# EAGLE schematic Development Board (EAGLE 9.6.2)
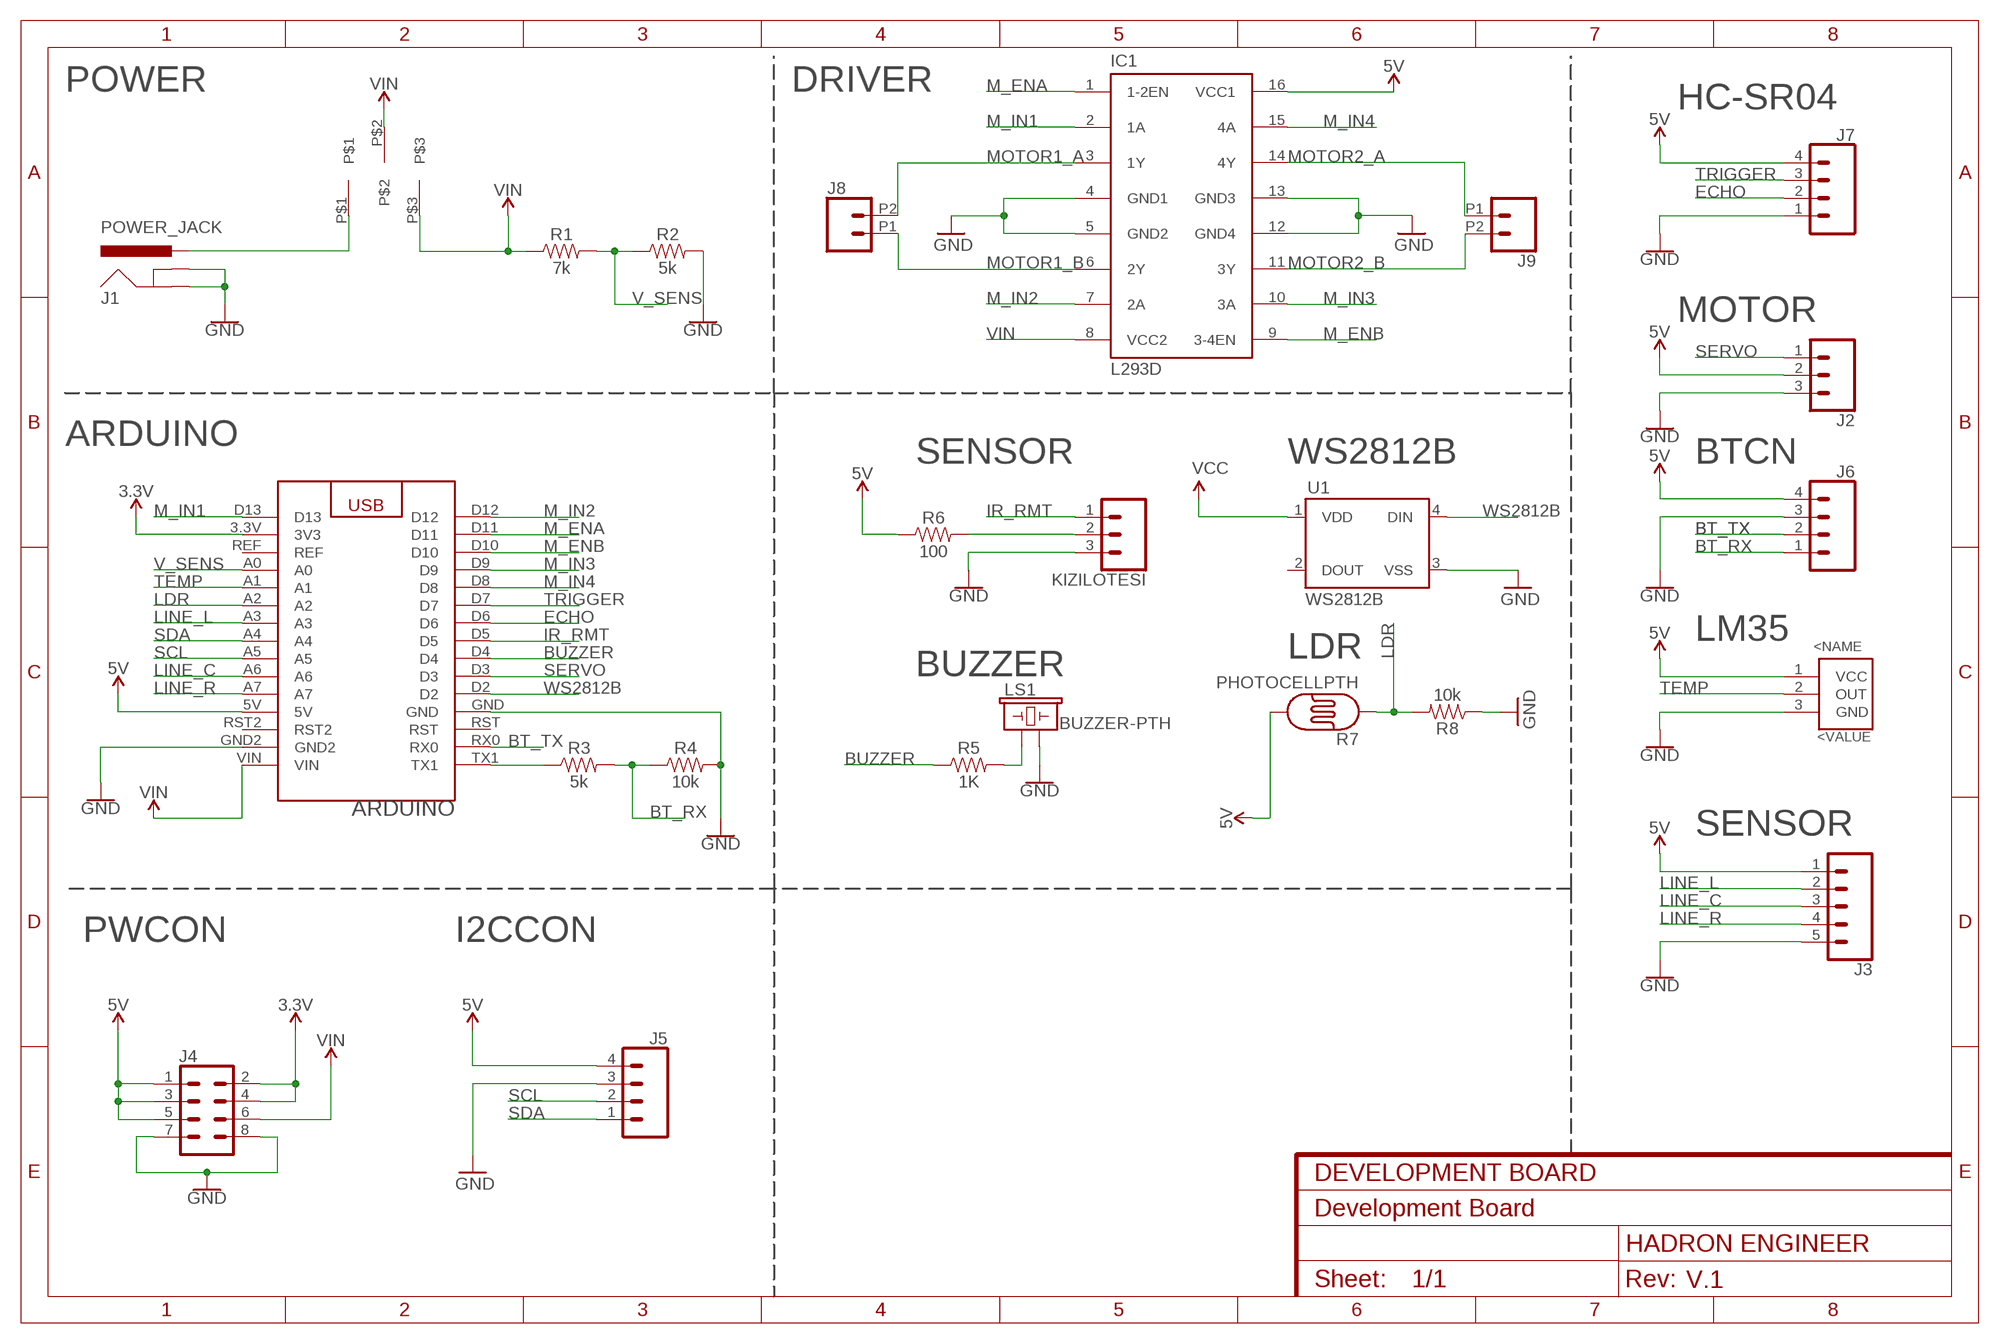
[diagram p0: schematic, sheet 1]
FRAME1 (FRAME-A4L): CNAME: DEVELOPMENT BOARD; CREVISION: V.1; DESIGNER: HADRON ENGINEER

## Parts
ARDUINO  ARDUINONANO  [ARDUINONANO]
IC1  L293D  [DIL16]
J1  POWER_JACK  [POWER_JACK_PTH]
J2  CONN_03  [1X03]
J3  CONN_05  [1X05]
J4  CONN_04X2  [2X4]
J5  CONN_04  [1X04]
J6  CONN_04  [1X04]
J7  CONN_04  [1X04]
J8  CONN_022.54MM_SCREWTERM  [1X02_2.54_SCREWTERM]
J9  CONN_022.54MM_SCREWTERM  [1X02_2.54_SCREWTERM]
KIZILOTESI  CONN_03  [1X03]
LM35  LM35  [TO-92]
LS1  BUZZER-PTH  [BUZZER-12MM]
R1  7k  10MOHM-HORIZ-1/4W-5%  [AXIAL-0.3]
R2  5k  10MOHM-HORIZ-1/4W-5%  [AXIAL-0.3]
R3  5k  10MOHM-HORIZ-1/4W-5%  [AXIAL-0.3]
R4  10k  10MOHM-HORIZ-1/4W-5%  [AXIAL-0.3]
R5  1K  10MOHM-HORIZ-1/4W-5%  [AXIAL-0.3]
R6  100  10MOHM-HORIZ-1/4W-5%  [AXIAL-0.3]
R7  PHOTOCELLPTH  [PHOTOCELL]
R8  10k  10MOHM-HORIZ-1/4W-5%  [AXIAL-0.3]
SW1  SWITCH  [SWITCH]
U1  WS2812B  [WS2812B]

## Nets
3.3V: ARDUINO.3.3V(3V3) J4.2 J4.4
5V: ARDUINO.5V IC1.16(VCC1) J2.2 J3.1 J4.1 J4.3 J4.5 J5.4 J6.4 J7.4 LM35.1(VCC) R6.P$1 R7.2
BT_RX: J6.1 R3.P$2 R4.P$1
BT_TX: ARDUINO.RX0 J6.2
BUZZER: ARDUINO.D4 R5.P$1
DO: J2.3 ; supply symbol labelled GND
ECHO: ARDUINO.D6 J7.2
GND: ARDUINO.GND ARDUINO.GND2 IC1.4(GND1) IC1.5(GND2) IC1.12(GND4) IC1.13(GND3) J1.GND J1.GNDBREAK J3.5 J4.7 J4.8 J5.3 J6.3 J7.1 KIZILOTESI.3 LM35.3(GND) LS1.- R2.P$2 R4.P$2 R8.P$1 U1.3(VSS)
IR_RMT: ARDUINO.D5 KIZILOTESI.1
LDR: ARDUINO.A2 R7.1 R8.P$2
LINE_C: ARDUINO.A6 J3.3
LINE_L: ARDUINO.A3 J3.2
LINE_R: ARDUINO.A7 J3.4
M_ENA: ARDUINO.D11 IC1.1(1-2EN)
M_ENB: ARDUINO.D10 IC1.9(3-4EN)
M_IN1: ARDUINO.D13 IC1.2(1A)
M_IN2: ARDUINO.D12 IC1.7(2A)
M_IN3: ARDUINO.D9 IC1.10(3A)
M_IN4: ARDUINO.D8 IC1.15(4A)
MOTOR1_A: IC1.3(1Y) J8.P2
MOTOR1_B: IC1.6(2Y) J8.P1
MOTOR2_A: IC1.14(4Y) J9.P1
MOTOR2_B: IC1.11(3Y) J9.P2
N$1: ARDUINO.TX1 R3.P$1
N$2: LS1.+ R5.P$2
N$3: J1.PWR SW1.P$1
N$4: KIZILOTESI.2 R6.P$2
SCL: ARDUINO.A5 J5.2
SDA: ARDUINO.A4 J5.1
SERVO: ARDUINO.D3 J2.1
TEMP: ARDUINO.A1 LM35.2(OUT)
TRIGGER: ARDUINO.D7 J7.3
V_SENS: ARDUINO.A0 R1.P$2 R2.P$1
VCC: U1.1(VDD)
VIN: ARDUINO.VIN IC1.8(VCC2) J4.6 R1.P$1 SW1.P$2 SW1.P$3
WS2812B: ARDUINO.D2 U1.4(DIN)
Unconnected: ARDUINO.REF ARDUINO.RST ARDUINO.RST2 U1.2(DOUT)

## Notes on the sheet
- POWER | DRIVER
- HC-SR04
- MOTOR
- ARDUINO
- SENSOR | WS2812B | BTCN
- LM35
- LDR
- BUZZER
- SENSOR
- PWCON | I2CCON

## Library data of the parts
ARDUINO = Arduino Paketi:ARDUINONANO: Arduino Nano Device
IC1 = st-microelectronics:L293D: PUSH-PULL 4 CHANNEL DRIVER; MPN: L293D; OC_FARNELL: 9589619; OC_NEWARK: 56P8249
J1 = SparkFun-Connectors:POWER_JACK: Power Jack Connector This is the standard 5.5mm barrel jack for power. The PTH is the most common, proven, reliable, footprint. The Slot footprint only works if the mill layer is transmitted to the PCB fab house so be warned. Here are the connectors we sell at SparkFun: DC Barrel Power Jack/Connector <https://www.sparkfun.com/products/119> (PRT-00119) DC Barrel Power Jack/Connector (SMD) <https://www.sparkfun.com/products/12748> (PRT-12748) DC Barrel Jack Adapter - Breadboard Compatible <https://www.sparkfun.com/products/10811> (PRT-10811) It is used on this SparkFun product (and many, many others): SparkFun RedBoard - Programmed with Arduino <https://www.sparkfun.com/products/12757> (DEV-12757) Also, if you need a mating power supply or connector, please check these out: Wall Adapter Power Supply - 9VDC 650mA <https://www.sparkfun.com/products/298> (TOL-00298) DC Barrel Jack Adapter - Male <https://www.sparkfun.com/products/10287> (PRT-10287); PROD_ID: CONN-08197
J2 KIZILOTESI = SparkFun-Connectors:CONN_03: Multi connection point. Often used as Generic Header-pin footprint for 0.1 inch spaced/style header connections On any of the 0.1 inch spaced packages, you can populate with these: Break Away Headers - Straight <https://www.sparkfun.com/products/116> (PRT-00116) Break Away Male Headers - Right Angle <https://www.sparkfun.com/products/553> (PRT-00553) Female Headers <https://www.sparkfun.com/products/115> (PRT-00115) Break Away Headers - Machine Pin <https://www.sparkfun.com/products/117> (PRT-00117) Break Away Female Headers - Swiss Machine Pin <https://www.sparkfun.com/products/743> (PRT-00743) Stackable Header - 3 Pin (Female, 0.1") <https://www.sparkfun.com/products/13875> (PRT-13875) For SCREWTERMINALS and SPRING TERMINALS visit here: Screw Terimnals on SparkFun.com <https://www.sparkfun.com/search/results?term=Screw+Terminals> (5mm/3.5mm/2.54mm spacing) This device is also useful as a general connection point to wire up your design to another part of your project. Our various solder wires solder well into these plated through hole pads. Hook-Up Wire - Assortment (Stranded, 22 AWG) <https://www.sparkfun.com/products/11375> (PRT-11375) Hook-Up Wire - Assortment (Solid Core, 22 AWG) <https://www.sparkfun.com/products/11367> (PRT-11367) View the entire wire category on our website here <https://www.sparkfun.com/categories/141> Special notes: Molex polarized connector foot print use with SKU : PRT-08232 with associated crimp pins and housings.
J3 = SparkFun-Connectors:CONN_05: Multi connection point. Often used as Generic Header-pin footprint for 0.1 inch spaced/style header connections On any of the 0.1 inch spaced packages, you can populate with these: Break Away Headers - Straight <https://www.sparkfun.com/products/116> (PRT-00116) Break Away Male Headers - Right Angle <https://www.sparkfun.com/products/553> (PRT-00553) Female Headers <https://www.sparkfun.com/products/115> (PRT-00115) Break Away Headers - Machine Pin <https://www.sparkfun.com/products/117> (PRT-00117) Break Away Female Headers - Swiss Machine Pin <https://www.sparkfun.com/products/743> (PRT-00743) For SCREWTERMINALS and SPRING TERMINALS visit here: Screw Terimnals on SparkFun.com <https://www.sparkfun.com/search/results?term=Screw+Terminals> (5mm/3.5mm/2.54mm spacing) This device is also useful as a general connection point to wire up your design to another part of your project. Our various solder wires solder well into these plated through hole pads. Hook-Up Wire - Assortment (Stranded, 22 AWG) <https://www.sparkfun.com/products/11375> (PRT-11375) Hook-Up Wire - Assortment (Solid Core, 22 AWG) <https://www.sparkfun.com/products/11367> (PRT-11367) View the entire wire category on our website here <https://www.sparkfun.com/categories/141> Special notes: Molex polarized connector foot print use with SKU : PRT-08231 with associated crimp pins and housings. 1MM SMD Version SKU: PRT-10208
J4 = SparkFun-Connectors:CONN_04X2: Multi connection point. Often used as Generic Header-pin footprint for 0.1 inch spaced/style header connections On any of the 0.1 inch spaced packages, you can populate with these: Break Away Headers - Straight <https://www.sparkfun.com/products/116> (PRT-00116) Break Away Male Headers - Right Angle <https://www.sparkfun.com/products/553> (PRT-00553) Female Headers <https://www.sparkfun.com/products/115> (PRT-00115) Break Away Headers - Machine Pin <https://www.sparkfun.com/products/117> (PRT-00117) Break Away Female Headers - Swiss Machine Pin <https://www.sparkfun.com/products/743> (PRT-00743)
J5-J7 = SparkFun-Connectors:CONN_04: Multi connection point. Often used as Generic Header-pin footprint for 0.1 inch spaced/style header connections On any of the 0.1 inch spaced packages, you can populate with these: Break Away Headers - Straight <https://www.sparkfun.com/products/116> (PRT-00116) Break Away Male Headers - Right Angle <https://www.sparkfun.com/products/553> (PRT-00553) Female Headers <https://www.sparkfun.com/products/115> (PRT-00115) Break Away Headers - Machine Pin <https://www.sparkfun.com/products/117> (PRT-00117) Break Away Female Headers - Swiss Machine Pin <https://www.sparkfun.com/products/743> (PRT-00743) For SCREWTERMINALS and SPRING TERMINALS visit here: Screw Terimnals on SparkFun.com <https://www.sparkfun.com/search/results?term=Screw+Terminals> (5mm/3.5mm/2.54mm spacing) This device is also useful as a general connection point to wire up your design to another part of your project. Our various solder wires solder well into these plated through hole pads. Hook-Up Wire - Assortment (Stranded, 22 AWG) <https://www.sparkfun.com/products/11375> (PRT-11375) Hook-Up Wire - Assortment (Solid Core, 22 AWG) <https://www.sparkfun.com/products/11367> (PRT-11367) View the entire wire category on our website here <https://www.sparkfun.com/categories/141> Special notes: Molex polarized connector foot print use with SKU : PRT-08231 with associated crimp pins and housings. 1MM SMD Version SKU: PRT-10208; PROD_ID: CONN-09696
J8 J9 = SparkFun-Connectors:CONN_02: Multi connection point. Often used as Generic Header-pin footprint for 0.1 inch spaced/style header connections On any of the 0.1 inch spaced packages, you can populate with these: Break Away Headers - Straight <https://www.sparkfun.com/products/116> (PRT-00116) Break Away Male Headers - Right Angle <https://www.sparkfun.com/products/553> (PRT-00553) Female Headers <https://www.sparkfun.com/products/115> (PRT-00115) Break Away Headers - Machine Pin <https://www.sparkfun.com/products/117> (PRT-00117) Break Away Female Headers - Swiss Machine Pin <https://www.sparkfun.com/products/743> (PRT-00743) For SCREWTERMINALS and SPRING TERMINALS visit here: Screw Terimnals on SparkFun.com <https://www.sparkfun.com/search/results?term=Screw+Terminals> (5mm/3.5mm/2.54mm spacing) This device is also useful as a general connection point to wire up your design to another part of your project. Our various solder wires solder well into these plated through hole pads. Hook-Up Wire - Assortment (Stranded, 22 AWG) <https://www.sparkfun.com/products/11375> (PRT-11375) Hook-Up Wire - Assortment (Solid Core, 22 AWG) <https://www.sparkfun.com/products/11367> (PRT-11367) View the entire wire category on our website here <https://www.sparkfun.com/categories/141> Special notes: Molex polarized connector foot print use with: PRT-08233 with associated crimp pins and housings. 2.54_SCREWTERM for use with PRT-10571. 3.5mm Screw Terminal footprints for PRT-08084 5mm Screw Terminal footprints for use with PRT-08432
LM35 = Arduino Paketi:LM35
LS1 = SparkFun-Electromechanical:BUZZER: Buzzer Small round buzzers that operate around the audible 2kHz range. You can use these as speakers to create simple music or user interfaces. Variant Overview: PTH - Mini Speaker - PC Mount 12mm 2.048kHz <https://www.sparkfun.com/products/7950> PTH_KIT - Mini Speaker - PC Mount 12mm 2.048kHz <https://www.sparkfun.com/products/7950> KIT simplifies soldering by adding stop mask to one side of the pads. PTH_NO_SILK - Mini Speaker - PC Mount 12mm 2.048kHz <https://www.sparkfun.com/products/7950> No silkscreen indicator of buzzer outline. PTH_KIT_NO_SILK - Mini Speaker - PC Mount 12mm 2.048kHz <https://www.sparkfun.com/products/7950> KIT package w/o silkscreen SMD - Buzzer Audio Magnetic (CCV-084B16) SMD buzzer used on, e.g. the LilyPad Buzzer <https://www.sparkfun.com/products/8463> and RFID USB Reader <https://www.sparkfun.com/products/9963>. SMD_KIT - Buzzer Audio Magnetic (CCV-084B16) SMD Buzzer with elongated pins to make soldering easier. Used on the SparkFun Simon Says - Surface Mount Soldering Kit <https://www.sparkfun.com/products/10935>.; PROD_ID: COMP-08253; SF_SKU: COM-07950
R1-R6 R8 = SparkFun-Resistors:10MOHM: RES-09327; PROD_ID: RES-09327; VALUE: 10M
R7 = SparkFun:PHOTOCELL: Photocell Also known as a CdS photoresistor. This is a low cost way to detect light levels. Resistance decreases with more incoming light. SparkFun SKU: SEN-09088
SW1 = SWITCH PACKET:SWITCH
U1 = SparkFun-LED:WS2812B: WS2812B - Intelligent control LED integrated light source Technical Specifications: Power Supply Voltage (VDD): 3.5 to 5.3 V Input Voltage (VI): -0.5 to VDD+0.5 V Operating Junction Temperature (Topt): -25°C to +80°C Storage Temperature Range (Tstg): -55°C to +150°C; PROD_ID: DIO-12503